# Altium schematic sheet Bandgap Reference.SchDoc
size A4; SheetNumber: 1; SheetTotal: 1
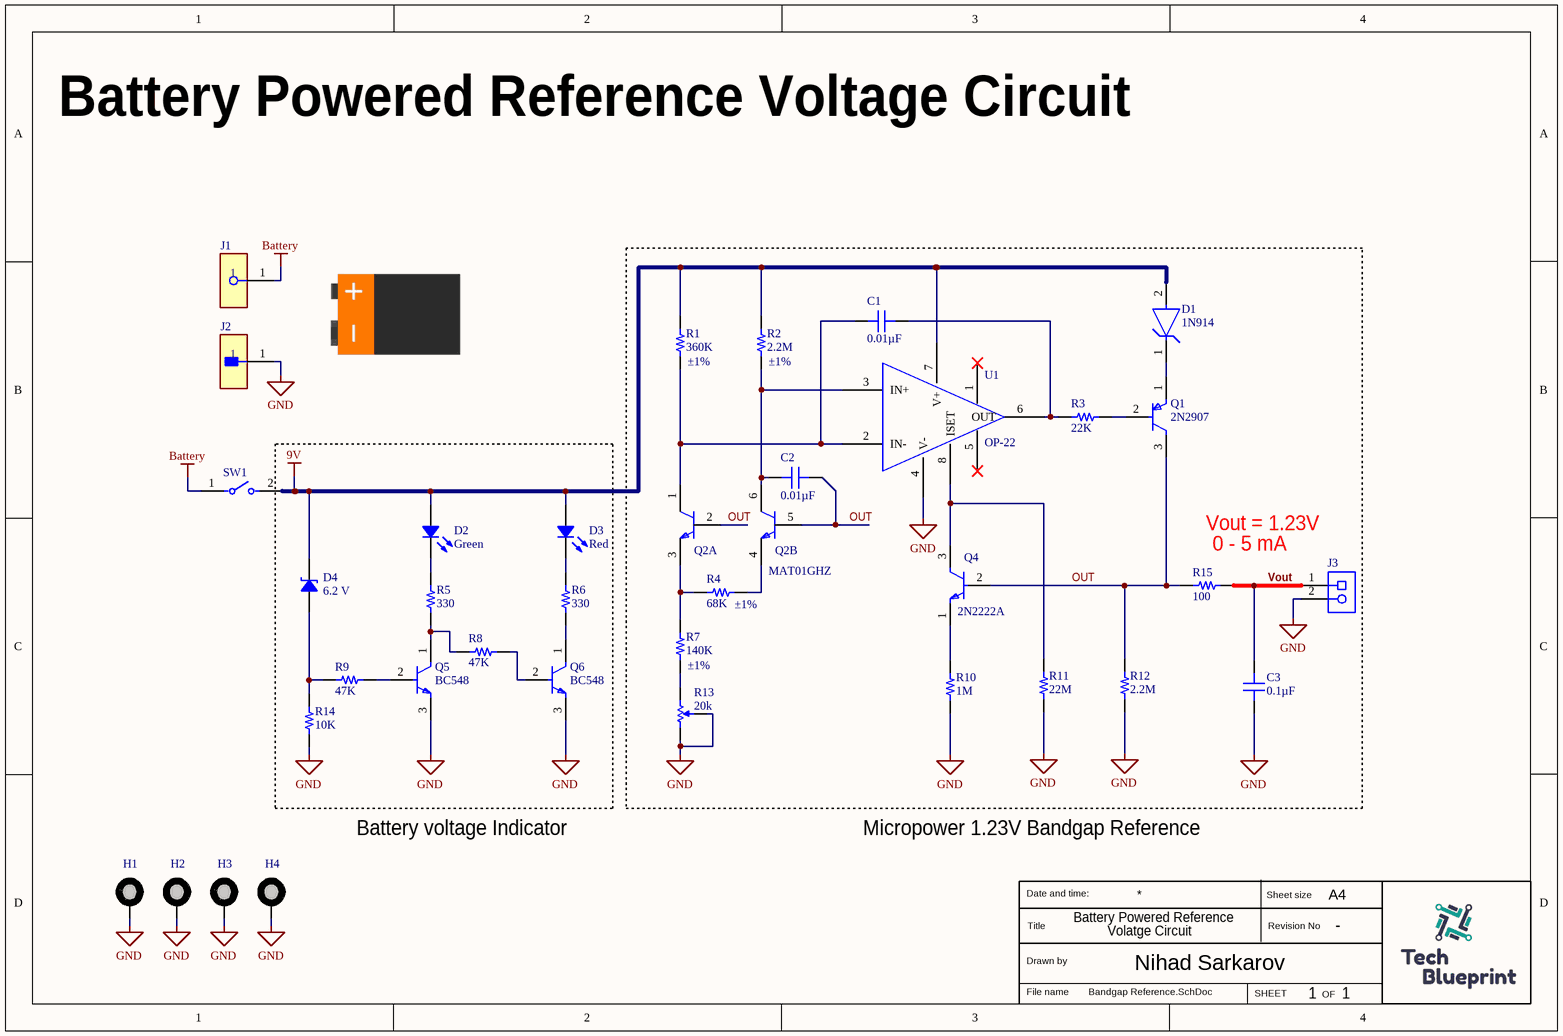
[diagram p0: Bandgap Reference.SchDoc]

## Parts
C1  Capacitance: 0.01µF  [CAP 1206_3216 - 0.8MM]  (hidden comment: 10000 pF)
C2  Capacitance: 0.01µF  [CAP 1206_3216 - 0.8MM]  (hidden comment: 10000 pF)
C3  0.1µF  [CAP 1206_3216 - 1.0MM]
D1  1N914  [FP-DO-213AA-MFG]
D2  Green  [LED 1206_3216 GREEN]
D3  Red  [LED 1206_3216 RED]
D4  Voltage - Zener (Nom) (Vz): 6.2 V  [DIODES SOT-323-3]  (hidden comment: BZX84W-B6V2F)
H1  Mounting Hole  [Mounting Hole]  (value not drawn)
H2  Mounting Hole  [Mounting Hole]  (value not drawn)
H3  Mounting Hole  [Mounting Hole]  (value not drawn)
H4  Mounting Hole  [Mounting Hole]  (value not drawn)
J1  594  [FP-594-MFG]  (value not drawn)
J2  593  [FP-593-MFG]  (value not drawn)
J3  1729128  [PHOE-1729128-2_V]  (value not drawn)
Q1  2N2907  [FP-TO-18-MFG]
Q2  MAT01GHZ  [FP-H-06-MFG]  (parts A,B of 2)
Q4  2N2222A  [FP-2N2222A-MFG]
Q5  BC548  [FP-135AN-MFG]
Q6  BC548  [FP-135AN-MFG]
R1  360K  Tolerance: ±1%  [RES 1206_3216]
R2  2.2M  Tolerance: ±1%  [RES 1206_3216]
R3  22K  [RES 1206_3216]
R4  68K  Tolerance: ±1%  [RES 1206_3216]
R5  330  [RES 1206_3216]
R6  330  [RES 1206_3216]
R7  140K  Tolerance: ±1%  [RES 1206_3216]
R8  47K  [RES 1206_3216]
R9  47K  [RES 1206_3216]
R10  1M  [RES 1206_3216]
R11  22M  [RES 1206_3216]
R12  2.2M  [RES 1206_3216]
R13  Resistance: 20k  [BOUR-3313J-1_V]  (hidden comment: 3313J-1-203E)
R14  10K  [RES 1206_3216]
R15  100  [RES 1206_3216]
SW1  BD01  [FP-BD01-MFG]  (value not drawn)
U1  OP-22  [CERDIP8_300MC_MCH]

## Nets
9V: D1.2(A) D2.1 D3.1 D4.2 R1.2 R2.2 SW1.2 U1.7(V+)
Battery: J1.1 SW1.1
GND: C3.1 H1.1 H2.1 H3.1 H4.1 J2.1 J3.2 Q5.3(E) Q6.3(E) R10.1 R11.1 R12.1 R13.1 R13.2 R14.1 U1.4(V-)
OUT: C2.2 Q1.3(C) Q2.2 Q2.5 Q4.2(B) R12.2 R15.1
Vout: C3.2 J3.1 R15.2
NetC1_1: C1.1 Q2.1 R1.1 U1.2(IN-)
NetC1_2: C1.2 R3.1 U1.6(OUT)
NetC2_1: C2.1 Q2.6 R2.1 U1.3(IN+)
NetD1_1: D1.1(C) Q1.1(E)
NetD2_2: D2.2 R5.2
NetD3_2: D3.2 R6.2
NetD4_1: D4.1 R9.1 R14.2
NetQ1_2: Q1.2(B) R3.2
NetQ2_3: Q2.3 R4.1 R7.2
NetQ2_4: Q2.4 R4.2
NetQ4_1: Q4.1(E) R10.2
NetQ4_3: Q4.3(C) R11.2 U1.8(ISET)
NetQ5_1: Q5.1(C) R5.1 R8.1
NetQ5_2: Q5.2(B) R9.2
NetQ6_1: Q6.1(C) R6.1
NetQ6_2: Q6.2(B) R8.2
NetR7_1: R7.1 R13.3

Not connected (* = marked no-connect by the designer): U1 1(BAL)* 5(BAL)*

## Notes on the sheet
- Battery Powered Reference Voltage Circuit
- Vout = 1.23V
- 0 - 5 mA
- Battery voltage Indicator
- Micropower 1.23V Bandgap Reference
- Battery Powered Reference
- Volatge Circuit
- -
- 1
- Date and time:
- Title
- Sheet size
- Revision No
- A4
- Drawn by
- File name
- Nihad Sarkarov
- SHEET
- OF

## Library data of the parts
C1 C2 = C1206C103KARECAUTO: CAP CER 1206 10NF 250V X7R 10%; manufacturer: KEMET; Part Number: C1206C103KARECAUTO; Applications: Automotive, ESD Protection; componentlink1description: Datasheet; componentlink1url: https://api.kemet.com/component-edge/download/datasheet/C1206C103KARECAUTO.pdf; componentlink2description: DigiKey Link; componentlink2url: https://www.digikey.com/en/products/detail/kemet/C1206C103KARECAUTO/8563702; Device Package: 1206 (3216 Metric); lastupdated: 6/4/2024 7:10:29 PM; Lifecycle Status: Active; Minimum Order: 1; Mounting Type: Surface Mount, MLCC; Operating Temperature: -55°C ~ 125°C; Package / Case: 1206 (3216 Metric); packaging: TapeAndReel; partid: 20579; Part Status: Active; price: 0.03; Ratings: AEC-Q200; series: ESD SMD Auto X7R; Size / Dimension: 0.126" L x 0.063" W (3.20mm x 1.60mm); Supplier 1: DigiKey; Supplier Part Number 1: 399-17174-1-ND; Temperature Coefficient: X7R; Thickness (Max): 0.035" (0.88mm); Tolerance: ±10%; value: 10000 pF; Voltage - Rated: 250V
C3 = LD065C104KAB2A: CAP CER 0.1UF 50V X7R 1206; manufacturer: AVX Corporation; Tolerance: ±10%; Part Number: LD065C104KAB2A; Capacitance: 0.1µF; Applications: General Purpose; componentlink1description: Datasheet; componentlink1url: http://datasheets.avx.com/LD-Series.pdf; componentlink2description: DigiKey Link; componentlink2url: http://digikey.com/product-detail/en/avx-corporation/LD065C104KAB2A/478-4932-1-ND/1858878; Device Package: 1206 (3216 Metric); lastupdated: 9/2/2020 1:05:06 AM; Lifecycle Status: Active; Minimum Order: 1; Mounting Type: Surface Mount, MLCC; Operating Temperature: -55°C ~ 125°C; Package / Case: 1206 (3216 Metric); packaging: TapeAndReel; partid: 18962; Part Status: Active; price: 0.15; series: LD; Size / Dimension: 0.126" L x 0.063" W (3.20mm x 1.60mm); Supplier 1: DigiKey; Supplier Part Number 1: 478-4932-1-ND; Temperature Coefficient: X7R; Thickness (Max): 0.037" (0.94mm); value: 0.1µF; Voltage - Rated: 50V
D1 = CMP-00252-10456399-1: JANTX1N914UR Signal Or Computer Diode Do-213Aa Rohs Compliant: Yes; Max Junction Temperature (Tj): 175°C; Max Reverse Voltage (DC): 75V; Element Configuration: Single; Average Rectified Current: 200mA; Max Forward Surge Current (Ifsm): 2A; Reverse Recovery Time: 5ns; Forward Voltage: 1.2V; Peak Reverse Current: 25nA; Capacitance: 4pF; Max Operating Temperature: 175°C; Mount: Surface Mount; Schedule B: 8541100070; Radiation Hardening: No; RoHS: Compliant; Number of Pins: 2; Reverse Voltage: 75V; Min Operating Temperature: -65°C; Max Repetitive Reverse Voltage (Vrrm): 75V; Height: 1.7mm; NexarPartId: 10456399; Peak Non-Repetitive Surge Current: 2A; Lifecycle Status: Production; Forward Current: 200mA
D2 = APT3216SGC: LED GREEN CLEAR CHIP SMD; Manufacturer: Kingbright; Configuration: Standard; Current - Test: 20mA; Lens Color: Colorless; Lens Size: 2.00mm x 1.60mm; Lens Style: Rectangle with Flat Top; Millicandela Rating: 12mcd; Viewing Angle: 120°; Voltage - Forward (Vf) (Typ): 2.2V; Wavelength - Dominant: 568nm; Wavelength - Peak: 565nm; Part Number: APT3216SGC; Color: Green; ComponentLink1Description: Datasheet; ComponentLink1URL: http://www.kingbrightusa.com/images/catalog/SPEC/APT3216SGC.pdf; ComponentLink2Description: DigiKey Link; ComponentLink2URL: https://www.digikey.com/en/products/detail/kingbright/APT3216SGC/1747540; Device Package: 1206 (3216 Metric); Height (Max): 0.75mm; LastUpdated: 6/3/2024 7:59:11 PM; Lens Transparency: Clear; Lifecycle Status: Active; Minimum Order: 1; Mounting Type: Surface Mount; Package / Case: 1206 (3216 Metric); Packaging: TapeAndReel; PartId: 526; Part Status: Active; Price: 0.05; Series: -; Size / Dimension: 3.20mm L x 1.60mm W; Supplier 1: DigiKey; Supplier Part Number 1: 754-1141-1-ND; Supplier Device Package: Chip LED; Value: Green
D3 = HSMC-C350: LED RED CHIP SMD; Manufacturer: Broadcom Limited; Configuration: Standard; Current - Test: 20mA; Lens Color: 1.20mm; Lens Size: 1.10mm Dia; Lens Style: Round with Domed Top; Viewing Angle: 70°; Voltage - Forward (Vf) (Typ): 2V; Wavelength - Dominant: 630nm; Wavelength - Peak: 643nm; Part Number: HSMC-C350; Color: Red; ComponentLink1Description: Datasheet; ComponentLink1URL: https://docs.broadcom.com/docs/HSMC-C350-DS100; ComponentLink2Description: DigiKey Link; ComponentLink2URL: https://www.digikey.com/en/products/detail/broadcom-limited/HSMC-C350/8509678; Device Package: 1206 (3216 Metric); Height (Max): 1.20mm; LastUpdated: 6/3/2024 8:00:41 PM; Lifecycle Status: Active; Minimum Order: 1; Mounting Type: Surface Mount; Package / Case: 1206 (3216 Metric); Packaging: TapeAndReel; PartId: 195; Part Status: Active; Price: 0.26; Series: -; Size / Dimension: 3.20mm L x 1.60mm W; Supplier 1: DigiKey; Supplier Part Number 1: 516-4369-1-ND; Supplier Device Package: Chip LED; Value: Red
D4 = BZX84W-B6V2F: DIODE ZENER 6.2V 275MW SOT323; Manufacturer: Nexperia USA Inc.; Current - Reverse Leakage @ Vr: 3 µA @ 4 V; Impedance (Max) (Zzt): 10 Ohms; Tolerance: ±2%; Voltage - Forward (Vf) (Max) @ If: 900 mV @ 10 mA; Part Number: BZX84W-B6V2F; ComponentLink1Description: Datasheet; ComponentLink1URL: https://assets.nexperia.com/documents/data-sheet/BZX84W_SER.pdf; ComponentLink2Description: DigiKey Link; ComponentLink2URL: https://www.digikey.com/en/products/detail/nexperia-usa-inc/BZX84W-B6V2F/9380695; LastUpdated: 6/3/2024 8:01:47 PM; Lifecycle Status: Active; Minimum Order: 1; Mounting Type: Surface Mount; Operating Temperature: 150°C (TJ); Package / Case: SC-70, SOT-323; Packaging: TapeAndReel; PartId: 809; Part Status: Active; Power - Max: 275 mW; Price: 0.02; Series: BZX84W; Supplier 1: DigiKey; Supplier Part Number 1: 1727-8280-1-ND; Supplier Device Package: SOT-323
J1 = CMP-19636-000029-1: BATTERY CONTACT SNAP 9V PC PIN; Body Material: Steel; Material Thickness: 0.15inch; Connector Type: Snap in; Number of Cells: 1; Gender: Female; Body Plating: Tin; Package Quantity: 100; Termination: PC Pin; Thickness: 0.015inch; Reach SVHC Compliant: Yes; RoHS Compliant: Yes; Length: 9.65mm; Contact Plating: Nickel; Contact Type: Snap-In; Material: Steel; Packaging: Bulk; Orientation: Right Angle; Mount: Through Hole; Lead Free: Lead Free; Series: -; Number of Batteries: 1; Contact Material: Steel
J2 = CMP-19636-000031-1: BATTERY CONTACT SNAP 9V PC PIN; Body Material: Steel; Number of Batteries: 1; Material Thickness: 0.15inch; Gender: Male; Body Plating: Tin; Connector Type: Snap in; Thickness: 0.015inch; Contact Material: Steel; RoHS Compliant: Yes; Package Quantity: 100; Length: 9.65mm; Series: -; Packaging: Bulk; Reach SVHC Compliant: Yes; Contact Plating: Nickel; Lead Free: Lead Free; Termination: PC Pin; Mount: Through Hole; Orientation: Right Angle; Material: Steel; Number of Cells: 1; Contact Type: Snap-In
J3 = CMP-2000-05815-1: PCB Terminal Block, 13.5 A, 400 V, 2-Pin THD, RoHS, Bulk; Manufacturer: Phoenix Contact; Package Version: 03/2015; No. of Rows: 1; Pitch: 5.08mm; No. of Positions: 2; Voltage Rating: 400V; Current Rating: 13500mA; Manufacturer URL: http://www.phoenixcontact.com/; Datasheet URL: https://datasheet.ciiva.com/16046/1729128-16046181.pdf; RoHS: TRUE; Package URL: https://www.phoenixcontact.com/online/portal/pi/pxc/product_detail_page/!ut/p/b1/3VdJjqNKFDxLH8AFycySyWY2ozFsEPOMMQaDOX1XedGL_1Vdm5YXJleknhSKeBkvI6EA8ncAo3AYoDhBQGco6KN7VURTdemj9us_IEKEZo_YHiPAEWEFmDGOHMORkqKYCORBZxgL7ZoaZYcbFFUZ3fqxSY6GOuxydWUuHqz1ynmMFygu583Bob0Ewr6Sd_l-5m-kAueHiB0jpRwZwe58wwtkpxtMYd_LmGcDRU02dRNEyWt6Y2ti5pSyJ_reIkzIulrqApdnbT11V5jnCKbYNCvhEM1MCpPByat_X379-iThf08CI5GfOPqfBeS3BRoBOdD55AKVv0iLwCMq-2BrzXWSGRH7pUGD9uwXQjiph3xL0DKQwdGa0JImiIOmBNOestqgwTHSSs2oOep-78apyXQBvNi8ZLaFjvjWvcaUEBu0MC6Wbe-d6mB0FAebo2lUWinqYaZs5DAYzV0RP9yitUjnGJ0iI9xhZkT42OCQNUJJhkgWINNQLP2JFP6OpMg3JCVg70jqHT0lvKOnhHf0lPuOnnLf0VPuWx6_dxwUIvwk5WMkT0kLL1mh61l2yZVSzG3pYV_bqo-mj6uMKwKwdnnW8Jh5RTOJzMOA5c-eJDaZQw4mTMPH02PvS_ZAqNVjVTo2WyYLkwH_KU1mmmG5kjRhDqPXLwwVHvVOjCM60-fpXvTDfMGW1PVFVS1r4e4yVDk4ZdNbkUHvqPqQSeian4UD39fNKmachqdJ1NJbyk8rXT9mXTvPk3oE5meulKGgiruPJek-4I9hTT6G8ZLOyRSm2RRVbThERQad5OS28hdt4YW4vG0stgYYzsWsK4_7y6DZMjJSCqri1kyiZR5vD7pwIrNR7QwPHTcLTI5qT7eRlpHrdGiupYlqQDJ7zy_CND8fWWBoLRXxk1RVcXiBQwbTD4Xi7KL-FuO94t9xaqweXzH; PartNumber: 1729128; Package Description: 2-Pin Through Hole Device, Body 8.1 x 10.16 mm, Pitch 5.08 mm; Datasheet Version: 12/2013; Mounting Technology: ThroughHole; Orientation: Horizontal; Package Reference: 1729128-2; Packing: Bulk
Q1 = CMP-00252-117134470-1: 2N2907 Small-Signal Bjt To-18 Rohs Compliant: Yes; Power Dissipation: 500mW; Number of Elements: 1; Collector Emitter Saturation Voltage: 1.6V; Max Junction Temperature (Tj): 200°C; Collector Emitter Voltage (VCEO): 60V; Max Collector Current: 600mA; hFE Min: 100; Emitter Base Voltage (VEBO): 5V; Height: 5.33mm; Max Operating Temperature: 200°C; NexarPartId: 117134470; Case/Package: TO-18; Lifecycle Status: Production; Collector Base Voltage (VCBO): 60V; Collector Emitter Breakdown Voltage: 60V; Min Operating Temperature: -65°C
Q2 = MAT01GHZ: TRANS 2NPN 45V 0.025A TO78-6; Transition Frequency: Mhz; Element Configuration: Dual; hFE Min: 250; Max Power Dissipation: 500mW; Max Collector Current: 25mA; RoHS Compliant: Yes; Max Operating Temperature: 125°C; Collector Emitter Voltage (VCEO): 45V; Case/Package: TO-78; Height: 4.7mm; Min Operating Temperature: -55°C
Q4 = CMP-50385-000001-1: T-NPN SI- AUDIO VHF AMP; Max Power Dissipation: 1.2W; Collector Emitter Breakdown Voltage: 40V; Transition Frequency: 300MHz; Polarity: NPN; Collector Emitter Voltage (VCEO): 40V; Lead Free: Contains Lead; Max Operating Temperature: 200°C; REACH SVHC: No SVHC; Case/Package: TO-18; Number of Pins: 3
Q5 Q6 = CMP-00278-84324557-1: BC548 Bulk Through Hole NPN Single Bipolar (BJT) Transistor 110 @ 2mA 5V 100mA 500mW 300MHz; Collector Emitter Breakdown Voltage: 30V; Collector Emitter Saturation Voltage: 250mV; hFE Min: 110; Number of Elements: 1; Gain Bandwidth Product: 300MHz; RoHS: Compliant; NexarPartId: 84324557; Polarity: NPN; Min Operating Temperature: -65°C; Number of Pins: 3; Termination: Through Hole; Mount: Through Hole; Voltage Rating (DC): 30V; Radiation Hardening: No; Frequency: 300MHz; Weight: 200mg; Max Frequency: 300MHz; Max Collector Current: 100mA; Transition Frequency: 300MHz; Max Power Dissipation: 500mW; Power Dissipation: 500mW; REACH SVHC: No SVHC; Collector Emitter Voltage (VCEO): 30V; Case/Package: TO-92; Max Operating Temperature: 150°C; Element Configuration: Single; Current Rating: 100mA; Lead Free: Lead Free; Collector Base Voltage (VCBO): 30V; Emitter Base Voltage (VEBO): 5V; Packaging: Bulk
R1 = 3430B2F360KTDF: 3430 B2 1% 360K 100PPM 1K RL; Manufacturer: TE Connectivity Passive Product; Power (Watts): 1.5W; Resistance: 360 kOhms; Temperature Coefficient: ±100ppm/°C; Value: 360 kOhms; Part Number: 3430B2F360KTDF; ComponentLink2Description: DigiKey Link; ComponentLink2URL: https://www.digikey.com/en/products/detail/te-connectivity-passive-product/3430B2F360KTDF/17764161; Composition: Thick Film; Device Package: 1206 (3216 Metric); Features: Automotive AEC-Q200; Height - Seated (Max): 0.026" (0.65mm); LastUpdated: 2/9/2024 8:52:53 PM; Lifecycle Status: Active; Minimum Order: 1; Number of Terminations: 2; Operating Temperature: -55°C ~ 155°C; Package / Case: 1206 (3216 Metric); Packaging: TapeAndReel; PartId: 77146; Part Status: Active; Price: 0.07; Ratings: AEC-Q200; Series: 3430; Size / Dimension: 0.061" L x 0.118" W (1.55mm x 3.00mm); Supplier 1: DigiKey; Supplier Part Number 1: 1712-3430B2F360KTDFCT-ND; Supplier Device Package: 0612
R2 R12 = ERJ-PM8F2204V: RES 2.2M OHM 1% 0.66W 1206; Manufacturer: Panasonic Electronic Components; Power (Watts): 0.667W, 2/3W; Resistance: 2.2 MOhms; Temperature Coefficient: ±100ppm/°C; Value: 2.2 MOhms; Part Number: ERJ-PM8F2204V; ComponentLink1Description: Datasheet; ComponentLink1URL: https://industrial.panasonic.com/cdbs/www-data/pdf/RDO0000/AOA0000C331.pdf; ComponentLink2Description: DigiKey Link; ComponentLink2URL: https://www.digikey.com/en/products/detail/panasonic-electronic-components/ERJ-PM8F2204V/16265782; Composition: Thick Film; Device Package: 1206 (3216 Metric); Features: Automotive AEC-Q200, Pulse Withstanding; Height - Seated (Max): 0.028" (0.70mm); LastUpdated: 2/9/2024 8:53:14 PM; Lifecycle Status: Active; Minimum Order: 1; Number of Terminations: 2; Operating Temperature: -55°C ~ 155°C; Package / Case: 1206 (3216 Metric); Packaging: TapeAndReel; PartId: 68714; Part Status: Active; Price: 0.03; Ratings: AEC-Q200; Series: ERJ-PM8; Size / Dimension: 0.126" L x 0.063" W (3.20mm x 1.60mm); Supplier 1: DigiKey; Supplier Part Number 1: 10-ERJ-PM8F2204VCT-ND; Supplier Device Package: 1206
  R12: Tolerance: ±1%
R3 = 3430B2F22KTDF: 3430 B2 1% 22K 100PPM 1K RL; Manufacturer: TE Connectivity Passive Product; Power (Watts): 1.5W; Resistance: 22 kOhms; Temperature Coefficient: ±100ppm/°C; Value: 22 kOhms; Part Number: 3430B2F22KTDF; ComponentLink2Description: DigiKey Link; ComponentLink2URL: https://www.digikey.com/en/products/detail/te-connectivity-passive-product/3430B2F22KTDF/17763028; Composition: Thick Film; Device Package: 1206 (3216 Metric); Features: Automotive AEC-Q200; Height - Seated (Max): 0.026" (0.65mm); LastUpdated: 2/9/2024 8:52:52 PM; Lifecycle Status: Active; Minimum Order: 1; Number of Terminations: 2; Operating Temperature: -55°C ~ 155°C; Package / Case: 1206 (3216 Metric); Packaging: TapeAndReel; PartId: 77235; Part Status: Active; Price: 0.07; Ratings: AEC-Q200; Series: 3430; Size / Dimension: 0.061" L x 0.118" W (1.55mm x 3.00mm); Supplier 1: DigiKey; Supplier Part Number 1: 1712-3430B2F22KTDFCT-ND; Supplier Device Package: 0612; Tolerance: ±1%
R4 = 3430B2F68KTDF: 3430 B2 1% 68K 100PPM 1K RL; Manufacturer: TE Connectivity Passive Product; Power (Watts): 1.5W; Resistance: 68 kOhms; Temperature Coefficient: ±100ppm/°C; Value: 68 kOhms; Part Number: 3430B2F68KTDF; ComponentLink2Description: DigiKey Link; ComponentLink2URL: https://www.digikey.com/en/products/detail/te-connectivity-passive-product/3430B2F68KTDF/17762904; Composition: Thick Film; Device Package: 1206 (3216 Metric); Features: Automotive AEC-Q200; Height - Seated (Max): 0.026" (0.65mm); LastUpdated: 2/9/2024 8:52:42 PM; Lifecycle Status: Active; Minimum Order: 1; Number of Terminations: 2; Operating Temperature: -55°C ~ 155°C; Package / Case: 1206 (3216 Metric); Packaging: TapeAndReel; PartId: 77735; Part Status: Active; Price: 0.07; Ratings: AEC-Q200; Series: 3430; Size / Dimension: 0.061" L x 0.118" W (1.55mm x 3.00mm); Supplier 1: DigiKey; Supplier Part Number 1: 1712-3430B2F68KTDFCT-ND; Supplier Device Package: 0612
R5 R6 = RCS1206330RJNEA: RCS1206 200 330R 5% ET1 E3; Manufacturer: Vishay Dale; Power (Watts): 0.5W, 1/2W; Resistance: 330 Ohms; Temperature Coefficient: ±200ppm/°C; Value: 330 Ohms; Part Number: RCS1206330RJNEA; ComponentLink1Description: Datasheet; ComponentLink1URL: http://www.vishay.com/docs/20065/rcse3.pdf; ComponentLink2Description: DigiKey Link; ComponentLink2URL: https://www.digikey.com/en/products/detail/vishay-dale/RCS1206330RJNEA/10059691; Composition: Thick Film; Device Package: 1206 (3216 Metric); Features: Automotive AEC-Q200, Pulse Withstanding; Height - Seated (Max): 0.026" (0.65mm); LastUpdated: 2/9/2024 8:53:54 PM; Lifecycle Status: Active; Minimum Order: 1; Number of Terminations: 2; Operating Temperature: -55°C ~ 155°C; Package / Case: 1206 (3216 Metric); Packaging: TapeAndReel; PartId: 40742; Part Status: Active; Price: 0.03; Ratings: AEC-Q200; Series: RCS e3; Size / Dimension: 0.126" L x 0.063" W (3.20mm x 1.60mm); Supplier 1: DigiKey; Supplier Part Number 1: 541-10625-1-ND; Supplier Device Package: 1206; Tolerance: ±5%
R7 = RMCF1206FT140K: RES 140K OHM 1% 1/4W 1206; Manufacturer: Stackpole Electronics Inc; Power (Watts): 0.25W, 1/4W; Resistance: 140 kOhms; Temperature Coefficient: ±100ppm/°C; Value: 140 kOhms; Part Number: RMCF1206FT140K; ComponentLink1Description: Datasheet; ComponentLink1URL: https://www.seielect.com/catalog/sei-rmcf_rmcp.pdf; ComponentLink2Description: DigiKey Link; ComponentLink2URL: https://www.digikey.com/en/products/detail/stackpole-electronics-inc/RMCF1206FT140K/1759984; Composition: Thick Film; Device Package: 1206 (3216 Metric); Features: Automotive AEC-Q200; Height - Seated (Max): 0.028" (0.70mm); LastUpdated: 2/9/2024 8:54:07 PM; Lifecycle Status: Active; Minimum Order: 1; Number of Terminations: 2; Operating Temperature: -55°C ~ 155°C; Package / Case: 1206 (3216 Metric); Packaging: TapeAndReel; PartId: 36791; Part Status: Active; Price: 0.01; Ratings: AEC-Q200; Series: RMCF; Size / Dimension: 0.126" L x 0.063" W (3.20mm x 1.60mm); Supplier 1: DigiKey; Supplier Part Number 1: 738-RMCF1206FT140KCT-ND; Supplier Device Package: 1206
R8 R9 = RCL061247K0JNEA: RES SMD 47K OHM 3/4W 1206 WIDE; Manufacturer: Vishay Dale; Power (Watts): 0.75W, 3/4W; Resistance: 47 kOhms; Temperature Coefficient: ±200ppm/°C; Tolerance: ±5%; Value: 47 kOhms; Part Number: RCL061247K0JNEA; ComponentLink1Description: Datasheet; ComponentLink1URL: http://www.vishay.com/docs/20046/rcle3.pdf; ComponentLink2Description: DigiKey Link; ComponentLink2URL: https://www.digikey.com/en/products/detail/vishay-dale/RCL061247K0JNEA/2587667; Composition: Thick Film; Device Package: 1206 (3216 Metric); Features: Automotive AEC-Q200; Height - Seated (Max): 0.026" (0.65mm); LastUpdated: 2/9/2024 8:53:59 PM; Lifecycle Status: Active; Minimum Order: 1; Number of Terminations: 2; Operating Temperature: -55°C ~ 155°C; Package / Case: 1206 (3216 Metric); Packaging: TapeAndReel; PartId: 60527; Part Status: Active; Price: 0.03; Ratings: AEC-Q200; Series: RCL; Size / Dimension: 0.063" L x 0.126" W (1.60mm x 3.20mm); Supplier 1: DigiKey; Supplier Part Number 1: 541-2376-1-ND; Supplier Device Package: 0612
R10 = 3430B2F1M0TDF: 3430 B2 1% 1M0 100PPM 1K RL; Manufacturer: TE Connectivity Passive Product; Power (Watts): 1.5W; Resistance: 1 MOhms; Temperature Coefficient: ±100ppm/°C; Value: 1 MOhms; Part Number: 3430B2F1M0TDF; ComponentLink2Description: DigiKey Link; ComponentLink2URL: https://www.digikey.com/en/products/detail/te-connectivity-passive-product/3430B2F1M0TDF/17763916; Composition: Thick Film; Device Package: 1206 (3216 Metric); Features: Automotive AEC-Q200; Height - Seated (Max): 0.026" (0.65mm); LastUpdated: 2/9/2024 8:52:45 PM; Lifecycle Status: Active; Minimum Order: 1; Number of Terminations: 2; Operating Temperature: -55°C ~ 155°C; Package / Case: 1206 (3216 Metric); Packaging: TapeAndReel; PartId: 77560; Part Status: Active; Price: 0.07; Ratings: AEC-Q200; Series: 3430; Size / Dimension: 0.061" L x 0.118" W (1.55mm x 3.00mm); Supplier 1: DigiKey; Supplier Part Number 1: 1712-3430B2F1M0TDFCT-ND; Supplier Device Package: 0612; Tolerance: ±1%
R11 = CRG1206F22M: RES SMD 22M OHM 1% 1/4W 1206; Manufacturer: TE Connectivity Passive Product; Power (Watts): 0.25W, 1/4W; Resistance: 22 MOhms; Temperature Coefficient: ±100ppm/°C; Value: 22 MOhms; Part Number: CRG1206F22M; ComponentLink1Description: Datasheet; ComponentLink1URL: https://www.te.com/commerce/DocumentDelivery/DDEController?Action=srchrtrv&DocNm=1773204&DocType=DS&DocLang=English; ComponentLink2Description: DigiKey Link; ComponentLink2URL: https://www.digikey.com/en/products/detail/te-connectivity-passive-product/CRG1206F22M/2381622; Composition: Thick Film; Device Package: 1206 (3216 Metric); Height - Seated (Max): 0.026" (0.65mm); LastUpdated: 2/9/2024 8:52:55 PM; Lifecycle Status: Active; Minimum Order: 1; Number of Terminations: 2; Operating Temperature: -55°C ~ 155°C; Package / Case: 1206 (3216 Metric); Packaging: TapeAndReel; PartId: 76687; Part Status: Active; Price: 0.06; Series: CRG, Neohm; Size / Dimension: 0.122" L x 0.061" W (3.10mm x 1.55mm); Supplier 1: DigiKey; Supplier Part Number 1: 1712-CRG1206F22MCT-ND; Supplier Device Package: 1206; Tolerance: ±1%
R13 = CMP-2000-05586-1: 3 mm Trimpot(R) Trimming Potentiometer, 20 KOhm, +/- 20%, 0.125 W, -55 to 125 degC, 3-Pin SMD, RoHS, Tape and Reel; Manufacturer: Bourns; Insulation Resistance: 100Megohms(Min.)@500VDC; Rotational Life: 100Cycles; Resolution: Infinite; Brand/Series: Trimpot®3313-SealedSeries; Temperature, Operating, Maximum: +125°C; Resistance, Insulation: 100Megohms; Material, Element: Cermet; Standards: RoHSCompliant; Dielectric Strength: 500VAC; Load Life: 1000hr@0.125W,70°C; Torque: 50g-cm; Temperature Coefficient: ±100ppm/°C; Number of Turns: 1; Power, Rating: 0.125W; Angle, Mechanical: 250°; Temperature, Operating, Minimum: -55°C; Package Reference: 3313J-1; Dimensions: 0.126"Lx0.138"Wx0.087"H; Tolerance: ±20%; Type: Trimmer; Package Description: 3-Pin Surface Mount Device, Body 3.5 x 3.2 mm, Pitch 1.15 mm; Mounting Technology: SurfaceMount; Datasheet URL: http://www.bourns.com/docs/Product-Datasheets/3313.pdf; Mounting Type: SurfaceMount; Manufacturer URL: http://www.bourns.com/; Datasheet Version: 05/2016; Termination: SMD
R14 = RCC120610K0JNEA: RCC1206 200 10K 5% ET1 E3; Manufacturer: Vishay Dale; Power (Watts): 0.5W, 1/2W; Resistance: 10 kOhms; Temperature Coefficient: ±200ppm/°C; Value: 10 kOhms; Part Number: RCC120610K0JNEA; ComponentLink1Description: Datasheet; ComponentLink1URL: https://www.vishay.com/doc?20066; ComponentLink2Description: DigiKey Link; ComponentLink2URL: https://www.digikey.com/en/products/detail/vishay-dale/RCC120610K0JNEA/13667093; Composition: Thick Film; Device Package: 1206 (3216 Metric); Features: Automotive AEC-Q200; Height - Seated (Max): 0.024" (0.60mm); LastUpdated: 2/9/2024 8:53:21 PM; Lifecycle Status: Active; Minimum Order: 1; Number of Terminations: 2; Operating Temperature: -55°C ~ 155°C; Package / Case: 1206 (3216 Metric); Packaging: TapeAndReel; PartId: 58363; Part Status: Active; Price: 0.03; Ratings: AEC-Q200; Series: RCC e3; Size / Dimension: 0.126" L x 0.063" W (3.20mm x 1.60mm); Supplier 1: DigiKey; Supplier Part Number 1: 541-RCC120610K0JNEACT-ND; Supplier Device Package: 1206; Tolerance: ±5%
R15 = 3430B2F100RTDF: 3430 B2 1% 100R 100PPM 1K RL; Manufacturer: TE Connectivity Passive Product; Power (Watts): 1.5W; Resistance: 100 Ohms; Temperature Coefficient: ±100ppm/°C; Value: 100 Ohms; Part Number: 3430B2F100RTDF; ComponentLink2Description: DigiKey Link; ComponentLink2URL: https://www.digikey.com/en/products/detail/te-connectivity-passive-product/3430B2F100RTDF/17764114; Composition: Thick Film; Device Package: 1206 (3216 Metric); Features: Automotive AEC-Q200; Height - Seated (Max): 0.026" (0.65mm); LastUpdated: 2/9/2024 8:52:45 PM; Lifecycle Status: Active; Minimum Order: 1; Number of Terminations: 2; Operating Temperature: -55°C ~ 155°C; Package / Case: 1206 (3216 Metric); Packaging: TapeAndReel; PartId: 77604; Part Status: Active; Price: 0.07; Ratings: AEC-Q200; Series: 3430; Size / Dimension: 0.061" L x 0.118" W (1.55mm x 3.00mm); Supplier 1: DigiKey; Supplier Part Number 1: 1712-3430B2F100RTDFCT-ND; Supplier Device Package: 0612; Tolerance: ±1%
SW1 = CMP-10033-000004-1: SWITCH SLIDE DIP SPST 100MA 5V; Max Voltage Rating (DC): 25V; Contact Current Rating: 25mA; Pitch: 0.1inch; Number of Circuits: 1; Actuator Material: Nylon; Life (Cycles): 10000Cycles; Body Material: PBT; Approvals: UL; Actuator Type: Slide (Standard); Washable: Yes; Actuator Length: 0.9mm; Capacitance: 5pF; Length: 0.18inch; Lead Free: Lead Free; Material: Nylon; Termination: PC Pin; Orientation: Straight; Throw Configuration: SPST; Case/Package: DIP; Package Quantity: 115; Packaging: Rail/Tube; Number of Positions: 1; Max Operating Temperature: 85°C; Terminal Pitch: 2.54mm; Mount: Through Hole; Min Operating Temperature: -40°C; RoHS Compliant: Yes; Depth: 9.65mm; Electrical Life: 10000Cycles; Series: BD; Contact Material: Bronze; Max Current Rating: 100mA; Current Rating: 100mA; Mechanical Life: 10000Cycles; Number of Poles: 1; REACH SVHC: No SVHC; Contact Plating: Gold; Radiation Hardening: No; Width: 9.65mm; Voltage Rating (DC): 5V
U1 = OP-22: Programmable micropower operational amplifier; Mfr_Name: Analog Devices; RefDes: RefDes; Type: Type; ComponentLink1Description: Datasheet; ComponentLink1URL: https://bg-electronics.de/datenblaetter/Schaltkreise/OP22.pdf